# Altium schematic sheet MOSFET_BANK.SchDoc
size C; SheetNumber: 3; SheetTotal: 5
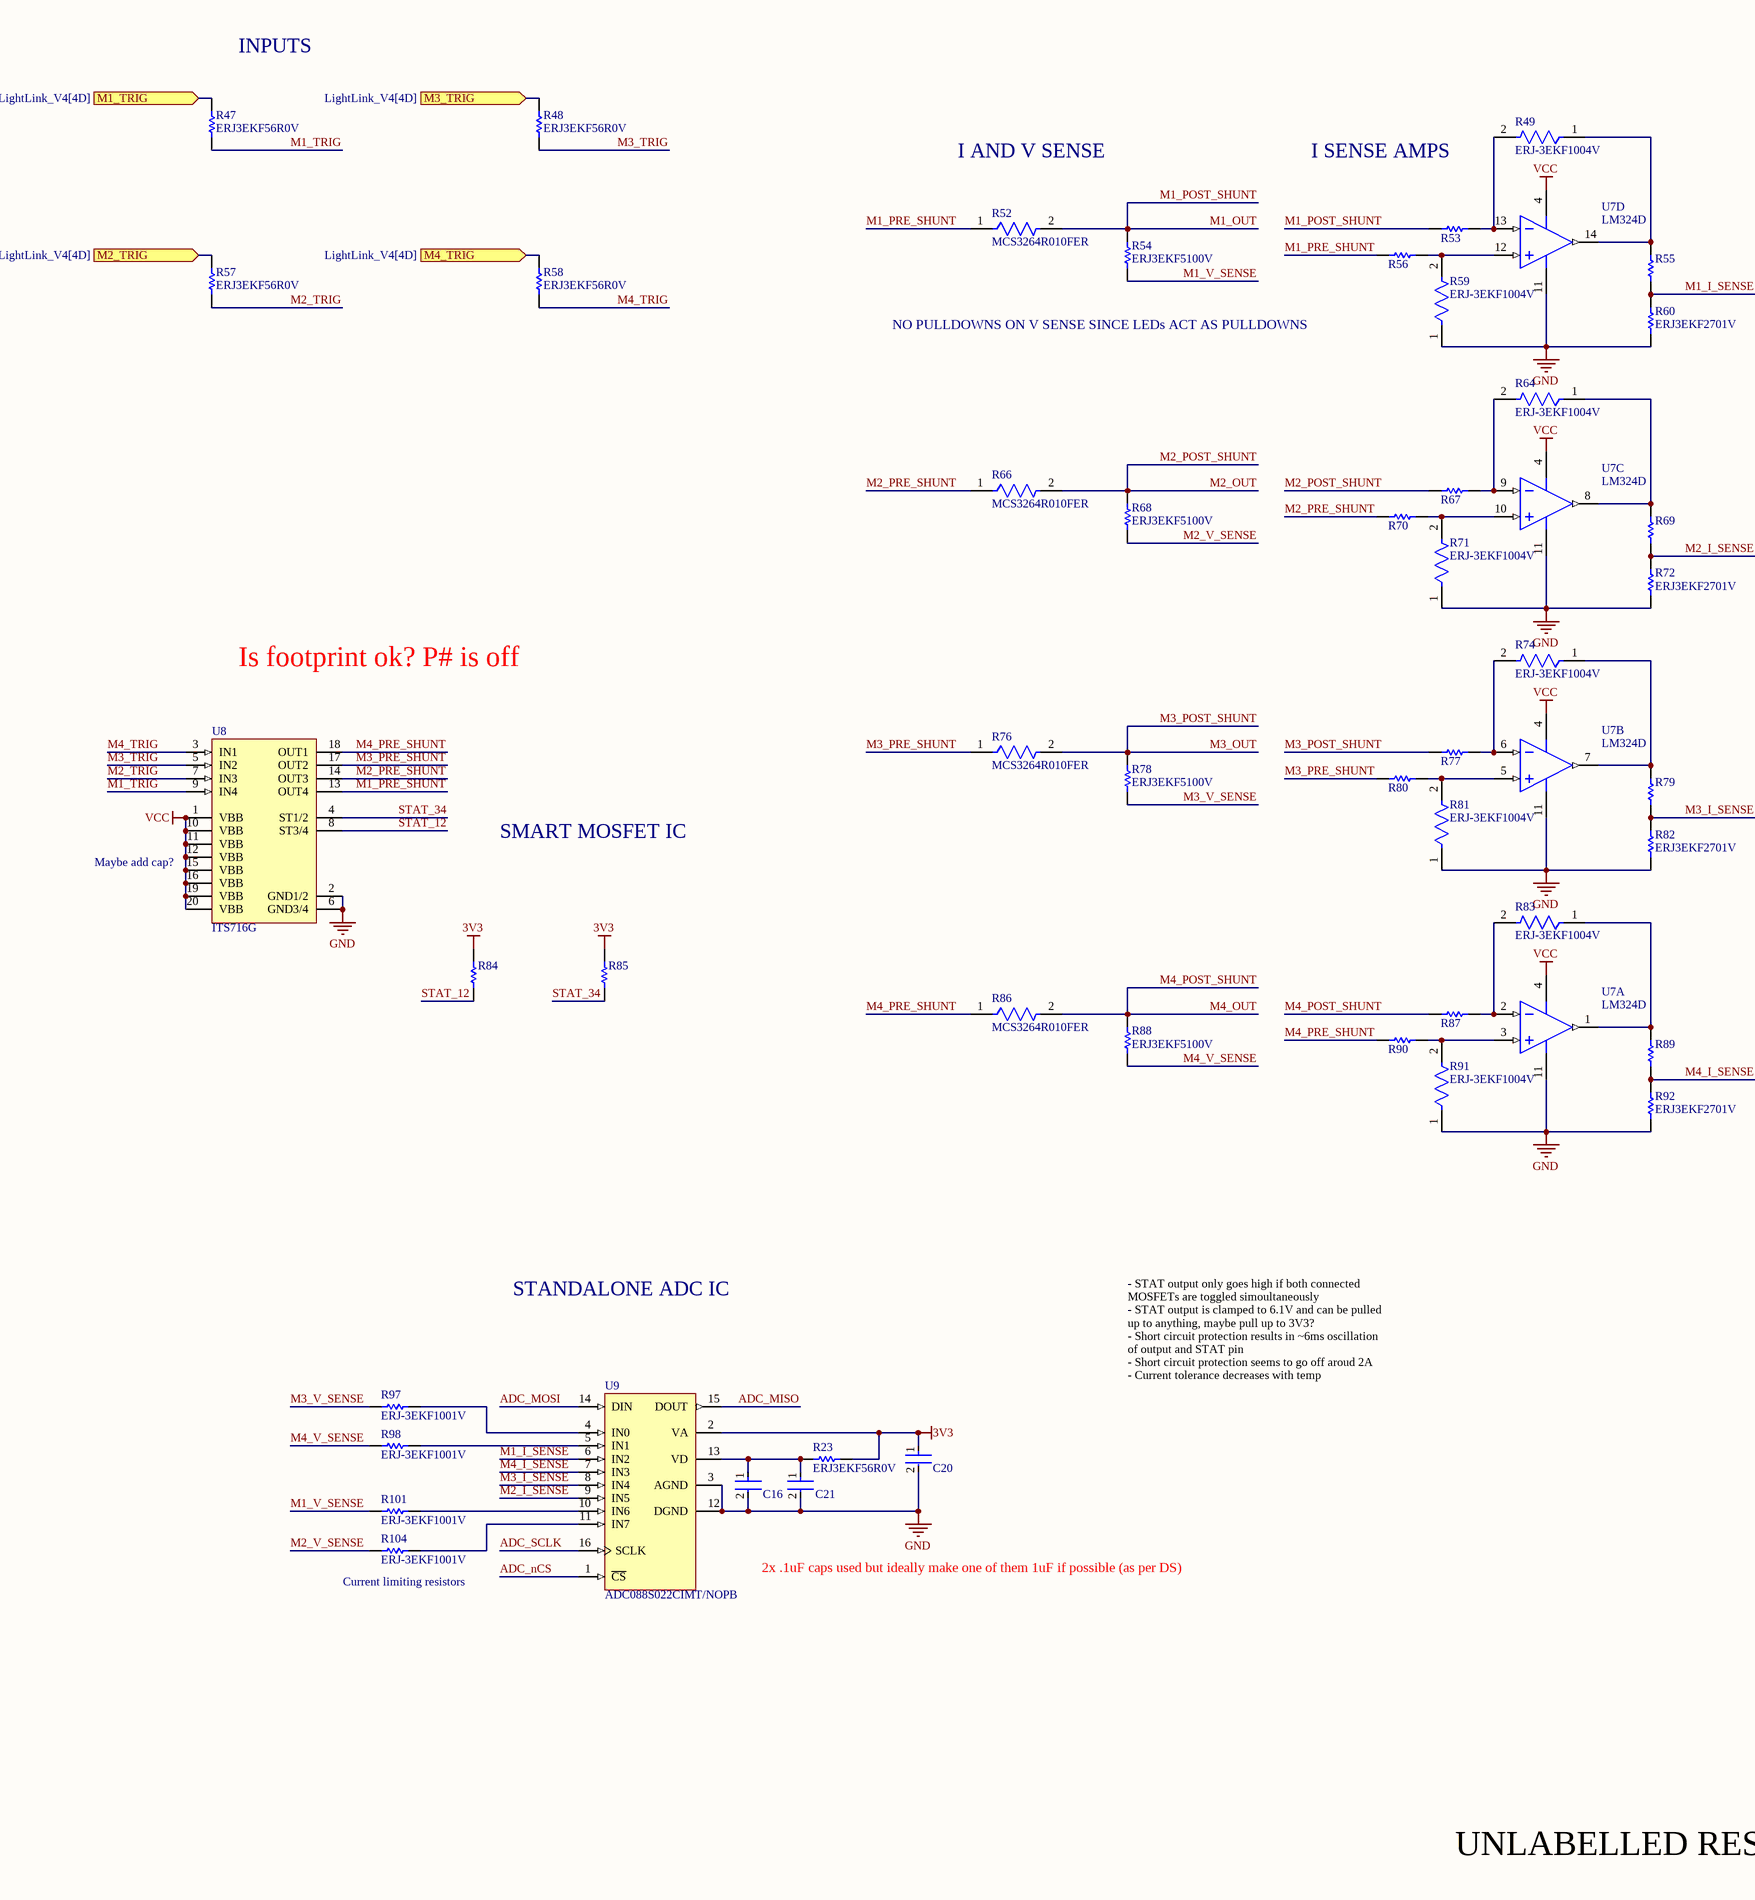
[diagram p0: MOSFET_BANK.SchDoc, left]
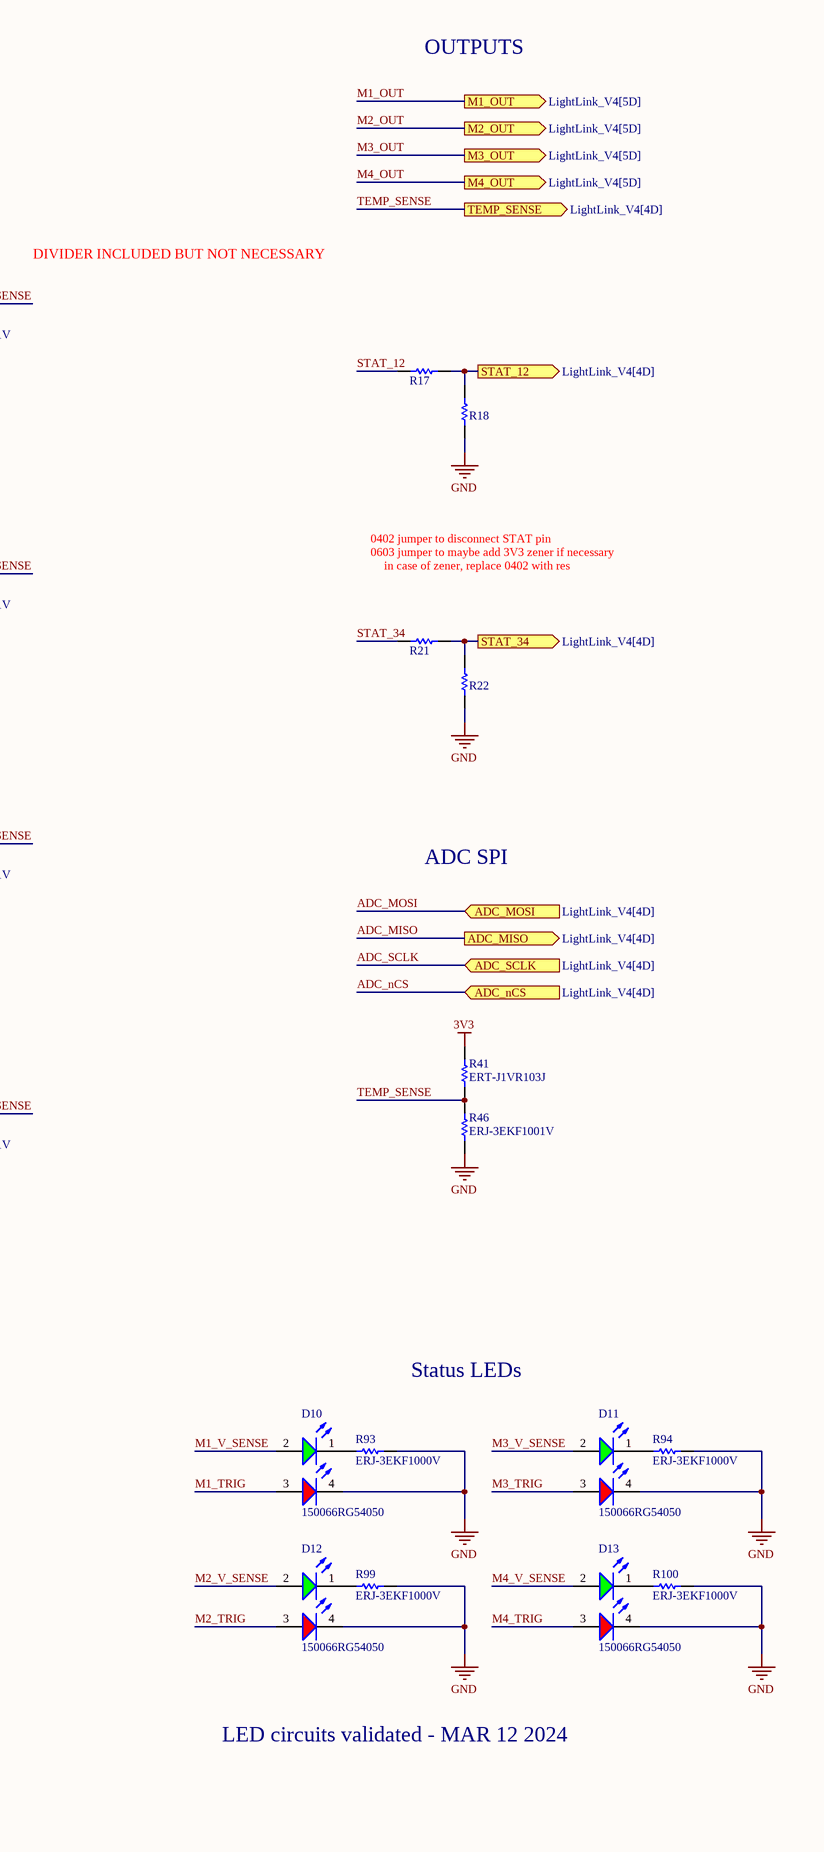
[diagram p1: MOSFET_BANK.SchDoc, right]

## Parts
C16  C0402C104K8PACTU  [FP-C0402-BB-MFG]  (value not drawn)
C20  C0402C104K8PACTU  [FP-C0402-BB-MFG]  (value not drawn)
C21  C0402C104K8PACTU  [FP-C0402-BB-MFG]  (value not drawn)
D10  150066RG54050  [WL-SBCD_0606]
D11  150066RG54050  [WL-SBCD_0606]
D12  150066RG54050  [WL-SBCD_0606]
D13  150066RG54050  [WL-SBCD_0606]
R17  0402 JUMPER 0 OHM  [RESC1005X40X25NL05T05]  (value not drawn)
R18  0603 JUMPER  [RESC1609X55X30ML15T15]  (value not drawn)
R21  0402 JUMPER 0 OHM  [RESC1005X40X25NL05T05]  (value not drawn)
R22  0603 JUMPER  [RESC1609X55X30ML15T15]  (value not drawn)
R23  ERJ3EKF56R0V  [RESC1608X55X30NL15T15]
R41  ERT-J1VR103J  [RESC1608X90X30ML15T20]
R46  ERJ-3EKF1001V  [RESC1608X55X30LL15T15]
R47  ERJ3EKF56R0V  [RESC1608X55X30NL15T15]
R48  ERJ3EKF56R0V  [RESC1608X55X30NL15T15]
R49  ERJ-3EKF1004V  [FP-ERJ3EK-IPC_C]
R52  MCS3264R010FER  [FP-MCS3264-MFG]
R53  ERJ3EKF1002V  [RESC1609X55X30LL15T15]  (value not drawn)
R54  ERJ3EKF5100V  [RESC1608X55X30NL15T15]
R55  ERJ3EKF1002V  [RESC1609X55X30LL15T15]  (value not drawn)
R56  ERJ3EKF1002V  [RESC1609X55X30LL15T15]  (value not drawn)
R57  ERJ3EKF56R0V  [RESC1608X55X30NL15T15]
R58  ERJ3EKF56R0V  [RESC1608X55X30NL15T15]
R59  ERJ-3EKF1004V  [FP-ERJ3EK-IPC_C]
R60  ERJ3EKF2701V  [RESC1608X55X30LL15T15]
R64  ERJ-3EKF1004V  [FP-ERJ3EK-IPC_C]
R66  MCS3264R010FER  [FP-MCS3264-MFG]
R67  ERJ3EKF1002V  [RESC1609X55X30LL15T15]  (value not drawn)
R68  ERJ3EKF5100V  [RESC1608X55X30NL15T15]
R69  ERJ3EKF1002V  [RESC1609X55X30LL15T15]  (value not drawn)
R70  ERJ3EKF1002V  [RESC1609X55X30LL15T15]  (value not drawn)
R71  ERJ-3EKF1004V  [FP-ERJ3EK-IPC_C]
R72  ERJ3EKF2701V  [RESC1608X55X30LL15T15]
R74  ERJ-3EKF1004V  [FP-ERJ3EK-IPC_C]
R76  MCS3264R010FER  [FP-MCS3264-MFG]
R77  ERJ3EKF1002V  [RESC1609X55X30LL15T15]  (value not drawn)
R78  ERJ3EKF5100V  [RESC1608X55X30NL15T15]
R79  ERJ3EKF1002V  [RESC1609X55X30LL15T15]  (value not drawn)
R80  ERJ3EKF1002V  [RESC1609X55X30LL15T15]  (value not drawn)
R81  ERJ-3EKF1004V  [FP-ERJ3EK-IPC_C]
R82  ERJ3EKF2701V  [RESC1608X55X30LL15T15]
R83  ERJ-3EKF1004V  [FP-ERJ3EK-IPC_C]
R84  ERJ3EKF1002V  [RESC1609X55X30LL15T15]  (value not drawn)
R85  ERJ3EKF1002V  [RESC1609X55X30LL15T15]  (value not drawn)
R86  MCS3264R010FER  [FP-MCS3264-MFG]
R87  ERJ3EKF1002V  [RESC1609X55X30LL15T15]  (value not drawn)
R88  ERJ3EKF5100V  [RESC1608X55X30NL15T15]
R89  ERJ3EKF1002V  [RESC1609X55X30LL15T15]  (value not drawn)
R90  ERJ3EKF1002V  [RESC1609X55X30LL15T15]  (value not drawn)
R91  ERJ-3EKF1004V  [FP-ERJ3EK-IPC_C]
R92  ERJ3EKF2701V  [RESC1608X55X30LL15T15]
R93  ERJ-3EKF1000V  [RESC1608X55X30LL15T15]
R94  ERJ-3EKF1000V  [RESC1608X55X30LL15T15]
R97  ERJ-3EKF1001V  [RESC1608X55X30LL15T15]
R98  ERJ-3EKF1001V  [RESC1608X55X30LL15T15]
R99  ERJ-3EKF1000V  [RESC1608X55X30LL15T15]
R100  ERJ-3EKF1000V  [RESC1608X55X30LL15T15]
R101  ERJ-3EKF1001V  [RESC1608X55X30LL15T15]
R104  ERJ-3EKF1001V  [RESC1608X55X30LL15T15]
U7  LM324D  [D0014A_L]  (parts A,B,C,D of 4)
U8  ITS716G  [INF-PG-DSO-20-32_L]
U9  ADC088S022CIMT/NOPB  [MTC16_L]

## Ports
ADC_MISO (out, see LightLink_V4[4D]), ADC_MOSI (in, see LightLink_V4[4D]), ADC_nCS (in, see LightLink_V4[4D]), ADC_SCLK (in, see LightLink_V4[4D]), M1_OUT (out, see LightLink_V4[5D]), M1_TRIG (in, see LightLink_V4[4D]), M2_OUT (out, see LightLink_V4[5D]), M2_TRIG (in, see LightLink_V4[4D]), M3_OUT (out, see LightLink_V4[5D]), M3_TRIG (in, see LightLink_V4[4D]), M4_OUT (out, see LightLink_V4[5D]), M4_TRIG (in, see LightLink_V4[4D]), STAT_12 (out, see LightLink_V4[4D]), STAT_34 (out, see LightLink_V4[4D]), TEMP_SENSE (out, see LightLink_V4[4D])

## Nets
3V3: C20.1 R23.1 R41.2 R84.2 R85.2 U9.2(VA)
GND: C16.2 C20.2 C21.2 D10.4(K) D11.4(K) D12.4(K) D13.4(K) R18.1 R22.1 R46.1 R59.1 R60.1 R71.1 R72.1 R81.1 R82.1 R91.1 R92.1 R93.2 R94.2 R99.2 R100.2 U7.11(GND) U8.2(GND1/2) U8.6(GND3/4) U9.3(AGND) U9.12(DGND)
VCC: U7.4(VCC) U8.1(VBB) U8.10(VBB) U8.11(VBB) U8.12(VBB) U8.15(VBB) U8.16(VBB) U8.19(VBB) U8.20(VBB)
ADC_MISO: U9.15(DOUT) ; port ADC_MISO
ADC_MOSI: U9.14(DIN) ; port ADC_MOSI
ADC_nCS: U9.1(~{CS}) ; port ADC_nCS
ADC_SCLK: U9.16(SCLK) ; port ADC_SCLK
M1_I_SENSE: R55.1 R60.2 U9.6(IN2)
M1_OUT: R52.2 R53.2 R54.2 ; port M1_OUT  [also labelled M1_POST_SHUNT]
M1_PRE_SHUNT: R52.1 R56.2 U8.13(OUT4)
M1_TRIG: D10.3(A) R47.1 U8.9(IN4)
M1_TRIG: R47.2 ; port M1_TRIG  [a separate net that carries the same name]
M1_V_SENSE: D10.2(A) R54.1 R101.1
M2_I_SENSE: R69.1 R72.2 U9.9(IN5)
M2_OUT: R66.2 R67.2 R68.2 ; port M2_OUT  [also labelled M2_POST_SHUNT]
M2_PRE_SHUNT: R66.1 R70.2 U8.14(OUT3)
M2_TRIG: D12.3(A) R57.1 U8.7(IN3)
M2_TRIG: R57.2 ; port M2_TRIG  [a separate net that carries the same name]
M2_V_SENSE: D12.2(A) R68.1 R104.1
M3_I_SENSE: R79.1 R82.2 U9.8(IN4)
M3_OUT: R76.2 R77.2 R78.2 ; port M3_OUT  [also labelled M3_POST_SHUNT]
M3_PRE_SHUNT: R76.1 R80.2 U8.17(OUT2)
M3_TRIG: D11.3(A) R48.1 U8.5(IN2)
M3_TRIG: R48.2 ; port M3_TRIG  [a separate net that carries the same name]
M3_V_SENSE: D11.2(A) R78.1 R97.1
M4_I_SENSE: R89.1 R92.2 U9.7(IN3)
M4_OUT: R86.2 R87.2 R88.2 ; port M4_OUT  [also labelled M4_POST_SHUNT]
M4_PRE_SHUNT: R86.1 R90.2 U8.18(OUT1)
M4_TRIG: D13.3(A) R58.1 U8.3(IN1)
M4_TRIG: R58.2 ; port M4_TRIG  [a separate net that carries the same name]
M4_V_SENSE: D13.2(A) R88.1 R98.1
STAT_12: R17.1 R84.1 U8.8(ST3/4)
STAT_12: R17.2 R18.2 ; port STAT_12  [a separate net that carries the same name]
STAT_34: R21.1 R85.1 U8.4(ST1/2)
STAT_34: R21.2 R22.2 ; port STAT_34  [a separate net that carries the same name]
TEMP_SENSE: R41.1 R46.2 ; port TEMP_SENSE
NetC16_1: C16.1 C21.1 R23.2 U9.13(VD)
NetD10_1: D10.1(K) R93.1
NetD11_1: D11.1(K) R94.1
NetD12_1: D12.1(K) R99.1
NetD13_1: D13.1(K) R100.1
NetR49_1: R49.1 R55.2 U7.14(4OUT)
NetR49_2: R49.2 R53.1 U7.13(4IN-)
NetR56_1: R56.1 R59.2 U7.12(4IN+)
NetR64_1: R64.1 R69.2 U7.8(3OUT)
NetR64_2: R64.2 R67.1 U7.9(3IN-)
NetR70_1: R70.1 R71.2 U7.10(3IN+)
NetR74_1: R74.1 R79.2 U7.7(2OUT)
NetR74_2: R74.2 R77.1 U7.6(2IN-)
NetR80_1: R80.1 R81.2 U7.5(2IN+)
NetR83_1: R83.1 R89.2 U7.1(1OUT)
NetR83_2: R83.2 R87.1 U7.2(1IN-)
NetR90_1: R90.1 R91.2 U7.3(1IN+)
NetR97_2: R97.2 U9.4(IN0)
NetR98_2: R98.2 U9.5(IN1)
NetR101_2: R101.2 U9.10(IN6)
NetR104_2: R104.2 U9.11(IN7)

## Notes on the sheet
- INPUTS
- OUTPUTS
- I AND V SENSE
- I SENSE AMPS
- DIVIDER INCLUDED BUT NOT NECESSARY
- (near R54) NO PULLDOWNS ON V SENSE SINCE LEDs ACT AS PULLDOWNS
- 0402 jumper to disconnect STAT pin
- 0603 jumper to maybe add 3V3 zener if necessary
- in case of zener, replace 0402 with res
- Is footprint ok? P# is off
- SMART MOSFET IC
- ADC SPI
- (near U8) Maybe add cap?
- STANDALONE ADC IC
- Status LEDs
- - STAT output only goes high if both connected MOSFETs are toggled simoultaneously
  - STAT output is clamped to 6.1V and can be pulled up to anything, maybe pull up to 3V3?
  - Short circuit protection results in ~6ms oscillation of output and STAT pin
  - Short circuit protection seems to go off aroud 2A
  - Current tolerance decreases with temp
- (near R104) Current limiting resistors
- 2x .1uF caps used but ideally make one of them 1uF if possible (as per DS)
- LED circuits validated - MAR 12 2024
- UNLABELLED RESISTORS ARE 10K

## Library data of the parts
C16 C20 C21 = CMP-2008-02046-2: CAP CER 0.1UF 10V X5R 0402; Manufacturer: Kemet; Material: Ceramic; Capacitance: 0.10 μF; Temperature Coefficient: 15%; Tolerance: 0.1; Value: 0.10 μF; Package: C0402-BB; Temperature: -55°C to +125°C; ComponentLink2Description: Datasheet; Temperature Characteristic: X5R; Device Class L1: Passive Components; Height: 0.55mm; Lead Free: Yes; ComponentLink2URL: https://content.kemet.com/datasheets/KEM_C1002_X7R_SMD.pdf; Device Class L2: Capacitors; Temperature Range Low: -55°C; Temperature Range High: +125°C; RoHS: TRUE; Octopart: https://octopart.com/c0402c104k8pactu-kemet-140039; Automotive: No; Mouser Description: Capacitor 100 nF 10 VDC 0402; Category: Cap; Voltage Rating: 10 V; Digikey Description: CAP CER 0.1UF 10V X5R 0402; Ipc Land Pattern Name: CAPC10050X50; Device Class L3: Ceramic Capacitors; Manufacturer Part Number: C0402C104K8PACTU
D10-D13 = CMP-004-00034-2: Led, Red/Grn, 180Mcd/230Mcd, 624Nm/525Nm Rohs Compliant: Yes
R17 R21 = CMP-009-00206-2: READ THE NAME
R18 R22 = CMP-009-00209-1: READ THE NAME
R23 R47 R48 R57 R58 = CMP-2000-00572-1: Manufacturer: Panasonic; Part Number: ERJ3EKF56R0V
R41 = CMP-2000-00869-1: Manufacturer: Panasonic; Part Number: ERT-J1VR103J
R46 R97 R98 R101 R104 = CMP-2000-00180-1: Manufacturer: Panasonic; Part Number: ERJ-3EKF1001V
R49 R59 R64 R71 R74 R81 R83 R91 = CMP-1012-00849-3: RES SMD 1M OHM 1% 1/10W 0603; Resistance: 1MR; Voltage Rating: 75V; Temperature Coefficient: 100ppm/°C; Power Rating: 100mW; REACH SVHC: No SVHC; Radiation Hardening: No; Features: Automotive AEC-Q200; Case Code (Metric): 1608; Resistance Tolerance: 1%; Case/Package: 0603; Termination: SMD/SMT; Max Operating Temperature: 155°C; Tolerance: 1%; Size Code: 0603; Case Code (Imperial): 0603; Min Operating Temperature: -55°C; Number of Pins: 2; Mount: Surface Mount; Package Quantity: 1; Military Standard: Not; Voltage Rating (DC): 75V; Depth: 0.8mm; Packaging: Tape and Reel; Width: 0.8mm; Number of Terminations: 2; Length: 1.6mm; Height: 0.022inch; RoHS Compliant: Yes; Resistor Type: Thick Film; Contact Plating: Tin; Lead Free: Lead Free; Series: ERJ; Construction: Rectangular; Max Power Dissipation: 100mW
R52 R66 R76 R86 = CMP-33361-000012-1: RES SMD 10 MOHM 1% 2W 3264; Temperature Coefficient: 50ppm/°C; Resistance: 10mR; Voltage Rating: 220mV; Case/Package: 2512; Military Standard: Not; Max Operating Temperature: 150°C; Height: 0.024inch; Package Quantity: 1; Case Code (Imperial): 2512; Number of Terminations: 2; Features: Flame Retardant Coating; Width: 0.126inch; Tolerance: 1%; Composition: Metal Element; Number of Pins: 2; Packaging: Tape and Reel; Depth: 3.2mm; Termination: SMD/SMT; Min Operating Temperature: -55°C; Power Rating: 2W; Case Code (Metric): 6432; Max Power Dissipation: 2W; Mount: Surface Mount; Length: 6.4mm
R53 R55 R56 R67 R69 R70 R77 R79 R80 R84 R85 R87 R89 R90 = CMP-1012-00623-3: Chip Resistor, 10 KOhm, +/- 1%, 0.1 W, -55 to 155 degC, 0603 (1608 Metric), RoHS, Tape and Reel; Manufacturer: Panasonic; Voltage Rating: 75V; Case\/Package: 0603; Power Rating: 100mW; Resistance: 10KOhm; Temperature Coefficient: 100ppm\/degreesC; Number of Pins: 2; Package Reference: 603; Depth: 0.8mm; Mount: SurfaceMount; Package Description: 2-Pin Surface Mount Device, Body 1.6 x 0.85 mm; Datasheet Version: 02/2017; Length: 1.6mm; Lead Free: LeadFree; Height: 0.45mm; Number of Terminations: 2; Max Power Dissipation: 100mW; Min Operating Temperature: -55degC; Datasheet URL: https://industrial.panasonic.com/cdbs/www-data/pdf/RDA0000/AOA0000C304.pdf; Termination: SMD/SMT; Case Code (Metric): 1608; Case Code (Imperial): 0603; Tolerance: 1%; Max Operating Temperature: 155degC; RoHSCompliant: true; Voltage Rating (DC): 75V; Radiation Hardening: No; Packaging: TapeandReel; Composition: ThickFilm; Mounting Technology: SurfaceMount; Manufacturer URL: http://www.panasonic.com/; Width: 0.031inch; REACH SVHC: NoSVHC; Contact Plating: Tin; Military Standard: Not; Package Quantity: 1
R54 R68 R78 R88 = CMP-2000-00539-1: Manufacturer: Panasonic; Part Number: ERJ3EKF5100V
R60 R72 R82 R92 = CMP-2000-00389-1: Manufacturer: Panasonic; Part Number: ERJ3EKF2701V
R93 R94 R99 R100 = CMP-2000-00179-1: Manufacturer: Panasonic; Part Number: ERJ-3EKF1000V
U7 = CMP-2000-06547-1: Quadruple Operational Amplifier, 0.5 V/us, 1.2 MHz, 3 to 32 V, 0 to 70 degC, 14-Pin SOIC (D), Green (RoHS & no Sb/Br), Tube; Manufacturer: Texas Instruments; Unity Gain Bandwidth Product: 1.2MHz; Input Offset Voltage: 7mV; Dual Supply Voltage (Max): ±16V; Single Supply Voltage (Min): 3V; Single Supply Voltage (Max): 32V; Voltage Gain in dB: 100dB; Power Supply Requirement: Single/Dual; Input Bias Current: 250nA; Dual Supply Voltage (Min): ±1.5V; Single Supply Voltage (Typ): 5/9/12/15/18/24/28V; Dual Supply Voltage (Typ): ±3/±5/±9/±12/±15V; Number of  Elements: 4; Common Mode Rejection Ratio: 65dB; Datasheet Version: Rev. W, 03/2015; Technology: Bipolar; Shut Down Feature: No; Package Reference: D0014A; Type: GeneralPurposeAmplifier; Pin Count: 14; Package Type: SOIC; Rail/Rail I/O Type: No; Manufacturer URL: http://www.ti.com/; Package Description: 14-Pin Small Outline Integrated Circuit, Body 8.65 x 3.9 mm, Pitch 1.27 mm; Operating Temperature Classification: Commercial; Datasheet URL: http://www.ti.com/lit/ds/symlink/lm324.pdf; Slew Rate: 0.5V/us; Package URL: http://www.ti.com/lit/ml/mpds177g/mpds177g.pdf; Mounting: SurfaceMount; Packaging: Rail/Tube; Mounting Technology: SurfaceMount; Operating Temp Range: 0Cto70C
U8 = CMP-1095-00041-1: Smart High-Side Power Switch for Industrial Applications 4 Channels: 4 x 140 mOhm Status Feedback, 5.5 to 40 V Operating, -30 to 85 degC, PG-DSO-20-32, Reel, Green; Manufacturer: Infineon; Green: TRUE; Operating Voltage Range (max): 40 V; Operating Voltage Range (min): 5.5Â V; Ptot (max): 3.6Â W; Diagnostic: Digital; IL (nom)min - one channel active: 2.3Â A; RON (max) @ Tj max: 280 mOhm; RON @ 25 degC: 140 mOhm (max); IL (SC): 9 A; IL (nom)min - all channels active: 1.3Â A; toff (max): 270 us; Channels: 4; ton (max): 250 us; ComponentLink1Description: Manufacturer URL; Packing: Reel; ComponentLink3Description: Package Specification; ComponentLink1URL: http://www.infineon.com/; Halogen-free: available; Mounting Technology: Surface Mount; PartNumber: ITS716G; ComponentLink3URL: http://www.infineon.com/dgdl/BTS+4130QGA_DS10+_neu.pdf?folderId=db3a304314dca389011537739e37155f&fileId=db3a30431a5c32f2011a957932285680&sId=db3a30433d68e984013d7f42d6576278; PackageVersion: Mar-08; ComponentLink2Description: Datasheet; ComponentLink2URL: http://www.infineon.com/dgdl/ITS716G_DS11_20081002.pdf?folderId=db3a304412b407950112b408e8c90004&fileId=db3a304412b407950112b428c2cf3e6d; DatasheetVersion: Rev. 1.1; PackageDescription: 20-Pin Plastic (Green) Dual Small Outline Package, 12.7 x 7.5 mm Body, 1.27 mm Pitch; Load Current (typ): 1.3Â A; PackageReference: PG-DSO-20-32; IL (SCp): 9 A
U9 = CMP-0054-00372-2: 8-Channel, 50 kSPS to 200 kSPS, 8-Bit A/D Converter, 16-pin TSSOP, Pb-Free; Manufacturer: National Semiconductor; PackageTopMarking: NSUZXYTT*88S022*CIMT; CompType: ADC IC; PowerWise: Y; ComponentLink2URL: http://www.national.com/pf/AD/ADC088S022.html; RoHS: Y; PackageDescription: Molded TSSOP, Jedec, 5 x 4.4 x 0.9mm Body, 16 Lead, 0.65mm Pitch; DatasheetVersion: Feb-2010; PinCount: 16; ComponentLink1Description: ADC088S022 Datasheet; Code_JEDEC: MO-153-AB; ComponentLink3URL: http://www.national.com/packaging/folders/mtc16.html; PackageVersion: revD, Jun-2003; ComponentLink3Description: MTC16 Package Page; RevisionNote: Component URLs added; ComponentLink1URL: http://www.national.com/ds/AD/ADC088S022.pdf; ComponentLink2Description: ADC088S022 Web Page; PackageReference: MTC16